# EAGLE schematic reflow-arduino-controller (EAGLE 9.6.2)
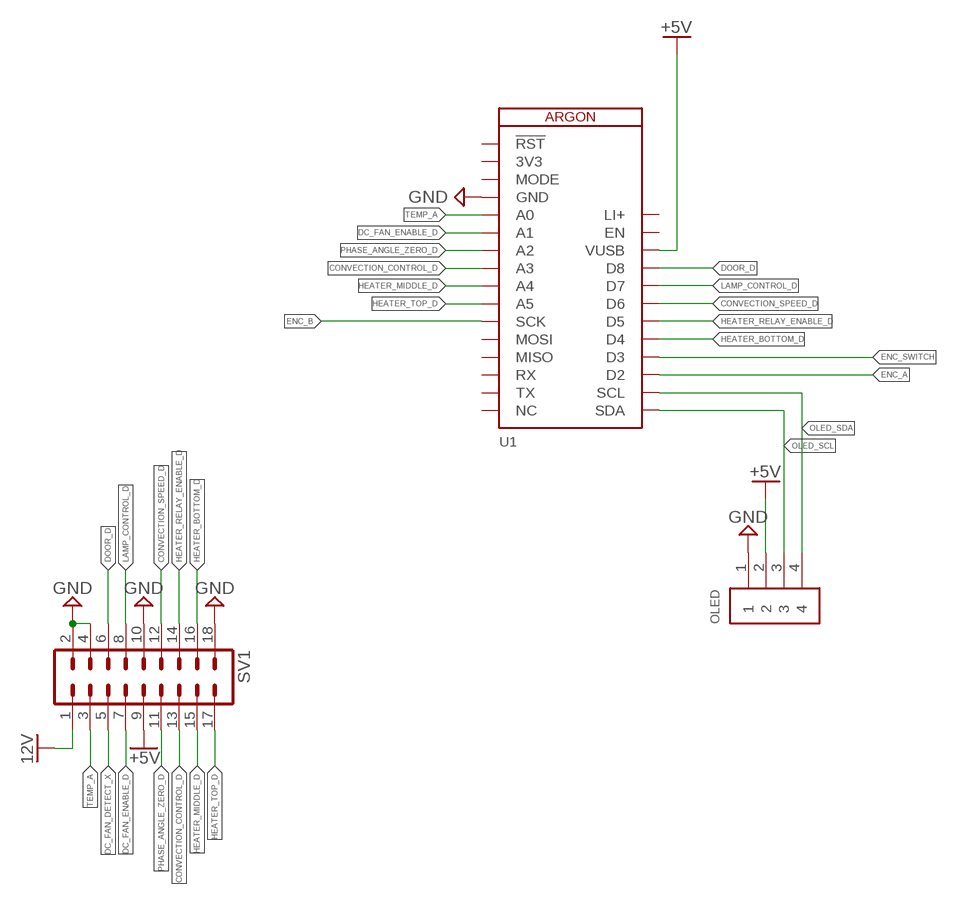
[diagram p0: schematic, sheet 1]

## Parts
OLED  61300411121  [61300411121]
SV1  MA09-2  [MA09-2]
U1  ARGON  [ARGON]

## Nets
12V: SV1.1
+5V: OLED.2 SV1.9 U1.26(VUSB)
CONVECTION_CONTROL_D: SV1.13 U1.8(A3)
CONVECTION_SPEED_D: SV1.12 U1.23(D6)
DC_FAN_DETECT_X: SV1.5
DC_FAN_ENABLE_D: SV1.7 U1.6(A1)
DOOR_D: SV1.6 U1.25(D8)
ENC_A: U1.19(D2)
ENC_B: U1.11(SCK)
ENC_SWITCH: U1.20(D3)
GND: OLED.1 SV1.2 SV1.4 SV1.10 SV1.18 U1.4(GND)
HEATER_BOTTOM_D: SV1.16 U1.21(D4)
HEATER_MIDDLE_D: SV1.15 U1.9(A4)
HEATER_RELAY_ENABLE_D: SV1.14 U1.22(D5)
HEATER_TOP_D: SV1.17 U1.10(A5)
LAMP_CONTROL_D: SV1.8 U1.24(D7)
OLED_SCL: OLED.3 U1.17(SDA)
OLED_SDA: OLED.4 U1.18(SCL)
PHASE_ANGLE_ZERO_D: SV1.11 U1.7(A2)
TEMP_A: SV1.3 U1.5(A0)
Unconnected: U1.1(!RST) U1.3(MODE) U1.12(MOSI) U1.13(MISO) U1.14(RX) U1.15(TX) U1.16(NC) U1.27(EN)

## Power pins joined to a net without a drawn wire
3V3: U1.2(3V3)
LI+: U1.28(LI+)

## Library data of the parts
OLED = Headers:61300411121: CONN HEADER VERT 4POS 2.54MM Manufacturer's datasheet <https://katalog.we-online.de/em/datasheet/6130xx11121.pdf>; CREATED_BY: PCBLayout.com; DIGI_KEY_PART_NUMBER: 732-5317-ND; MANUFACTURER: Wurth Electronics Inc.; MPN: 61300411121
SV1 = con-lstb:MA09-2: PIN HEADER; OC_FARNELL: unknown; OC_NEWARK: unknown
U1 = Particle-Devices:ARGON: ARGON The Particle Argon is a powerful Wi-Fi development kit that you can use as a standalone Wi-Fi device or Wi-Fi enabled gateway, repeater, or endpoint for Particle Mesh networks. More information: https://docs.particle.io/argon/ Footprint and formfactor based on Adafruit Feather. <https://www.adafruit.com/feather>